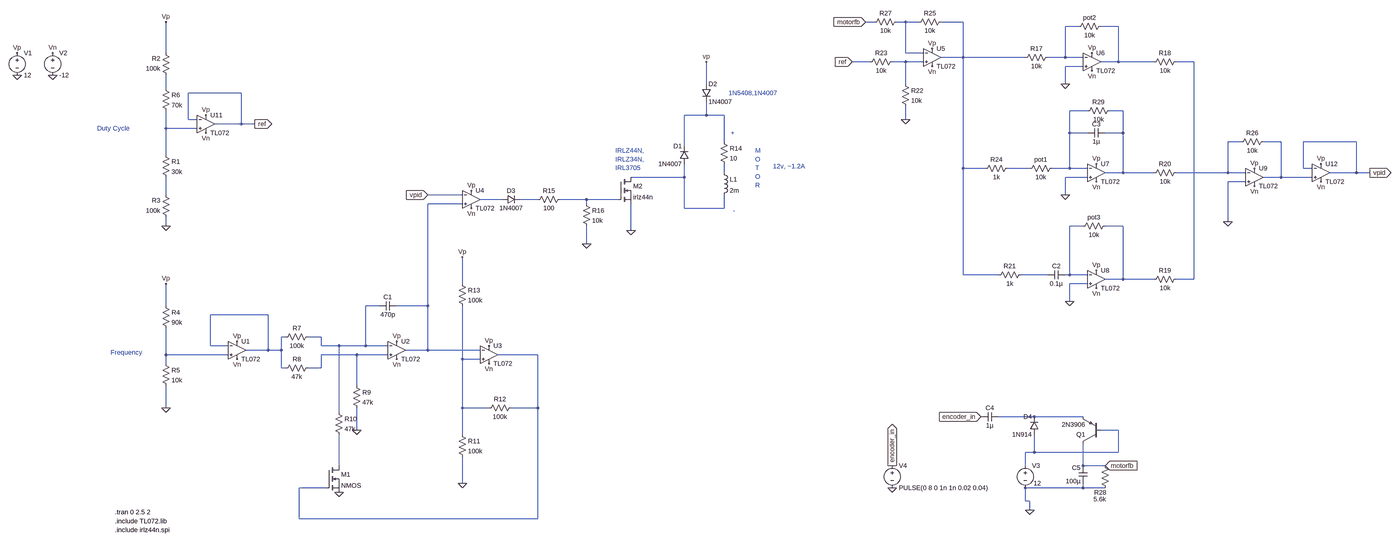
[diagram p0: schematic fvc2.asc, whole sheet]
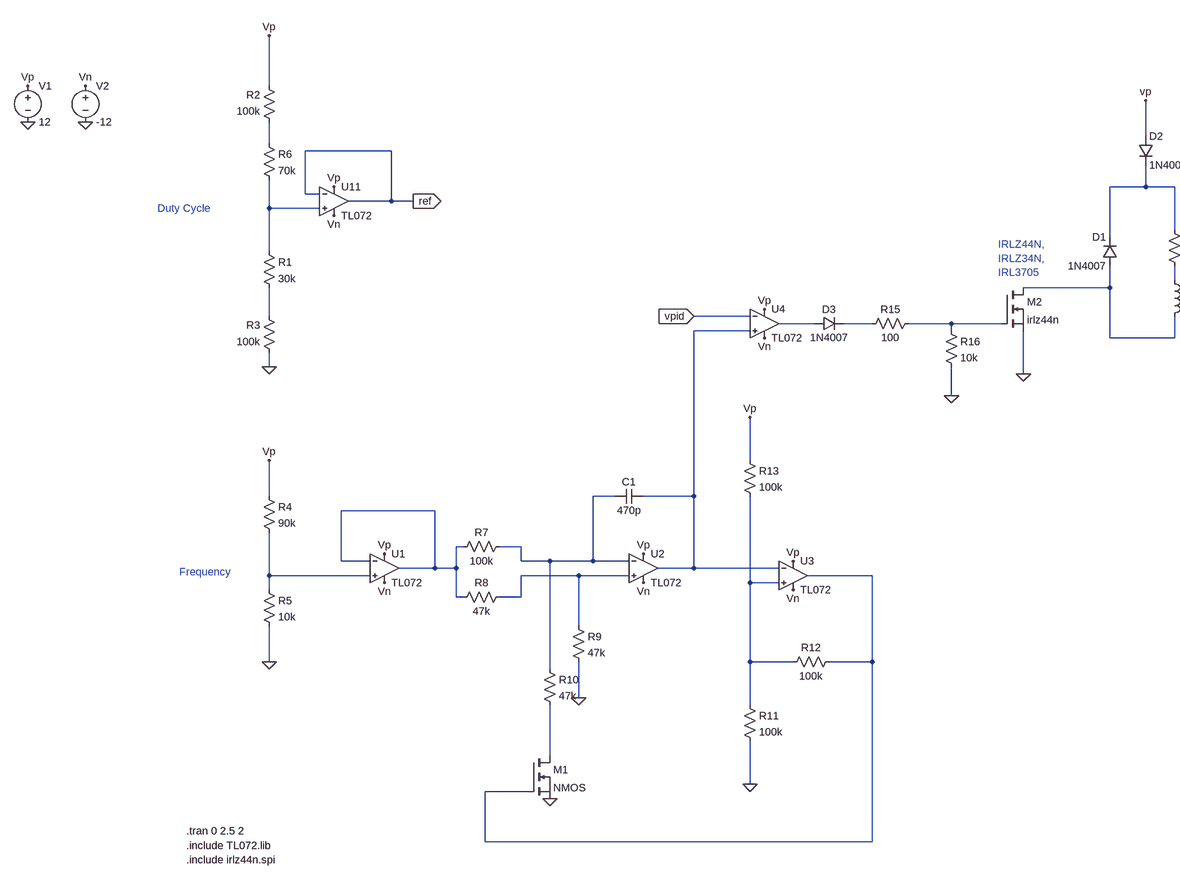
[diagram p1: schematic fvc2.asc, part, row 1 of 1, column 1 of 2]
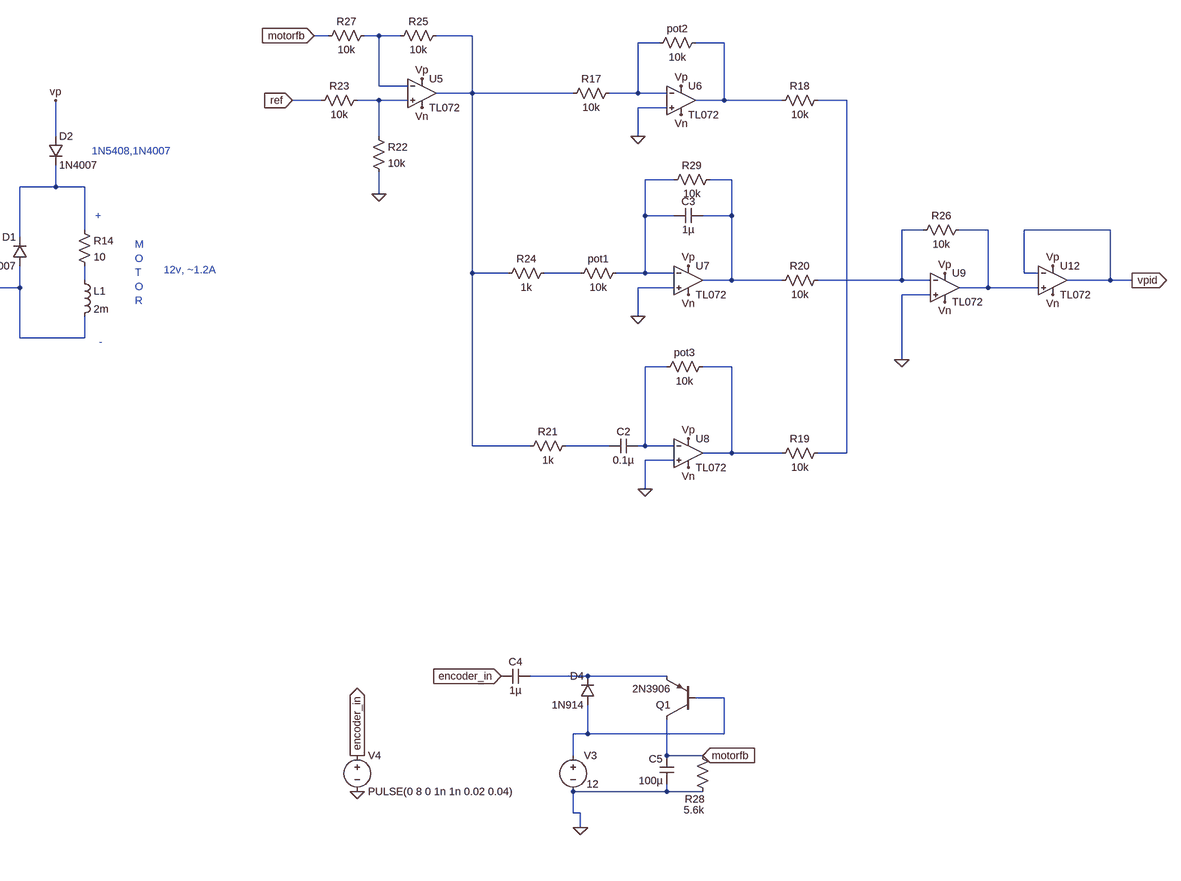
[diagram p2: schematic fvc2.asc, part, row 1 of 1, column 2 of 2]
fvc2.asc, the LTspice schematic file:
Version 4.1
SHEET 1 4284 1492
WIRE 1584 -1024 1552 -1024
WIRE 1696 -1024 1664 -1024
WIRE 1744 -1024 1696 -1024
WIRE 1904 -1024 1824 -1024
WIRE 2320 -1008 2272 -1008
WIRE 2464 -1008 2400 -1008
WIRE -1088 -912 -1088 -1024
WIRE 1696 -912 1696 -1024
WIRE 1760 -912 1696 -912
WIRE 1904 -896 1904 -1024
WIRE 1904 -896 1824 -896
WIRE 2128 -896 1904 -896
WIRE 2272 -896 2272 -1008
WIRE 2272 -896 2208 -896
WIRE 2336 -896 2272 -896
WIRE 1568 -880 1504 -880
WIRE 1696 -880 1648 -880
WIRE 1760 -880 1696 -880
WIRE 2464 -880 2464 -1008
WIRE 2464 -880 2400 -880
WIRE 2592 -880 2464 -880
WIRE 2736 -880 2672 -880
WIRE 2336 -864 2272 -864
WIRE 896 -800 896 -880
WIRE 1696 -800 1696 -880
WIRE 2272 -800 2272 -864
WIRE -1088 -784 -1088 -832
WIRE -816 -768 -1008 -768
WIRE 2352 -704 2288 -704
WIRE 2480 -704 2432 -704
WIRE 896 -688 896 -736
WIRE 896 -688 816 -688
WIRE 960 -688 896 -688
WIRE -1008 -672 -1008 -768
WIRE -976 -672 -1008 -672
WIRE 1696 -672 1696 -720
WIRE -816 -656 -816 -768
WIRE -816 -656 -912 -656
WIRE -768 -656 -816 -656
WIRE -1088 -640 -1088 -704
WIRE -976 -640 -1088 -640
WIRE 2288 -624 2288 -704
WIRE 2352 -624 2288 -624
WIRE 2480 -624 2480 -704
WIRE 2480 -624 2416 -624
WIRE 960 -592 960 -688
WIRE 2928 -592 2880 -592
WIRE 3072 -592 3008 -592
WIRE 3344 -592 3152 -592
WIRE 816 -576 816 -688
WIRE -1088 -544 -1088 -640
WIRE 1904 -496 1904 -896
WIRE 1984 -496 1904 -496
WIRE 2144 -496 2064 -496
WIRE 2288 -496 2288 -624
WIRE 2288 -496 2224 -496
WIRE 2352 -496 2288 -496
WIRE 3152 -496 3152 -592
WIRE 3184 -496 3152 -496
WIRE 960 -480 960 -512
WIRE 2480 -480 2480 -624
WIRE 2480 -480 2416 -480
WIRE 2592 -480 2480 -480
WIRE 2880 -480 2880 -592
WIRE 2880 -480 2672 -480
WIRE 2944 -480 2880 -480
WIRE 3344 -480 3344 -592
WIRE 3344 -480 3248 -480
WIRE 3392 -480 3344 -480
WIRE 816 -464 816 -512
WIRE 816 -464 624 -464
WIRE 2352 -464 2272 -464
WIRE 3072 -464 3072 -592
WIRE 3072 -464 3008 -464
WIRE 3184 -464 3072 -464
WIRE 2944 -448 2880 -448
WIRE -1088 -400 -1088 -464
WIRE 16 -400 -144 -400
WIRE 2272 -400 2272 -464
WIRE 160 -384 80 -384
WIRE 288 -384 224 -384
WIRE 464 -384 368 -384
WIRE 576 -384 464 -384
WIRE 16 -368 -144 -368
WIRE 464 -368 464 -384
WIRE 816 -352 816 -464
WIRE 960 -352 960 -400
WIRE 960 -352 816 -352
WIRE 2880 -304 2880 -448
WIRE -1088 -288 -1088 -320
WIRE 2336 -288 2288 -288
WIRE 2480 -288 2416 -288
WIRE 624 -272 624 -368
WIRE 464 -224 464 -288
WIRE 1904 -112 1904 -496
WIRE 2032 -112 1904 -112
WIRE 2208 -112 2112 -112
WIRE 2288 -112 2288 -288
WIRE 2288 -112 2272 -112
WIRE 2352 -112 2288 -112
WIRE 2480 -96 2480 -288
WIRE 2480 -96 2416 -96
WIRE 2592 -96 2480 -96
WIRE 2736 -96 2736 -880
WIRE 2736 -96 2672 -96
WIRE 16 -80 16 -176
WIRE 2352 -80 2288 -80
WIRE 2288 -16 2288 -80
WIRE -1088 0 -1088 -80
WIRE -320 0 -368 0
WIRE -144 0 -144 -368
WIRE -144 0 -256 0
WIRE -720 32 -928 32
WIRE -656 112 -672 112
WIRE -528 112 -576 112
WIRE -928 144 -928 32
WIRE -864 144 -928 144
WIRE -528 144 -528 112
WIRE -464 144 -528 144
WIRE -368 144 -368 0
WIRE -368 144 -464 144
WIRE -288 144 -368 144
WIRE -720 160 -720 32
WIRE -720 160 -800 160
WIRE -672 160 -672 112
WIRE -672 160 -720 160
WIRE -144 160 -144 0
WIRE -144 160 -224 160
WIRE 80 160 -144 160
WIRE -1088 176 -1088 80
WIRE -864 176 -1088 176
WIRE -400 176 -528 176
WIRE -288 176 -400 176
WIRE 288 176 144 176
WIRE 16 192 16 0
WIRE 80 192 16 192
WIRE -1088 208 -1088 176
WIRE -672 224 -672 160
WIRE -656 224 -672 224
WIRE -528 224 -528 176
WIRE -528 224 -576 224
WIRE -400 288 -400 176
WIRE -1088 368 -1088 288
WIRE 16 368 16 192
WIRE 112 368 16 368
WIRE 288 368 288 176
WIRE 288 368 192 368
WIRE -464 384 -464 144
WIRE 2160 400 2032 400
WIRE 2336 400 2160 400
WIRE -400 448 -400 368
WIRE 2464 448 2400 448
WIRE 16 464 16 368
WIRE 2160 528 2160 464
WIRE 2160 528 2128 528
WIRE 2464 528 2464 448
WIRE 2464 528 2160 528
WIRE -464 576 -464 464
WIRE 2128 576 2128 528
WIRE 2336 576 2336 496
WIRE 2416 576 2336 576
WIRE 16 640 16 544
WIRE -512 656 -608 656
WIRE 2336 656 2336 640
WIRE 2336 656 2128 656
WIRE 2416 656 2336 656
WIRE 2128 704 2128 656
WIRE 2144 704 2128 704
WIRE 2144 736 2144 704
WIRE -608 768 -608 656
WIRE 288 768 288 368
WIRE 288 768 -608 768
FLAG -1648 -832 0
FLAG -1520 -832 0
FLAG -1648 -912 Vp
FLAG -1520 -912 Vn
FLAG -1088 -288 0
FLAG -1088 -1024 Vp
FLAG -1088 -80 Vp
FLAG -1088 368 0
FLAG 48 -416 Vp
FLAG 48 -352 Vn
FLAG 112 208 Vn
FLAG -256 192 Vn
FLAG -832 192 Vn
FLAG 112 144 Vp
FLAG -256 128 Vp
FLAG -832 128 Vp
FLAG -400 448 0
FLAG -464 672 0
FLAG 16 640 0
FLAG 16 -176 Vp
FLAG 624 -272 0
FLAG 464 -224 0
FLAG 896 -880 vp
FLAG 2272 -800 0
FLAG 2272 -400 0
FLAG 2288 -16 0
FLAG 2880 -304 0
FLAG 1696 -672 0
FLAG 1552 -1024 motorfb
IOPIN 1552 -1024 In
FLAG 1504 -880 ref
IOPIN 1504 -880 In
FLAG -768 -656 ref
IOPIN -768 -656 Out
FLAG -144 -400 vpid
IOPIN -144 -400 In
FLAG 2144 736 0
FLAG 1968 400 encoder_in
IOPIN 1968 400 In
FLAG 1648 656 0
FLAG 1648 576 encoder_in
IOPIN 1648 576 Out
FLAG 2416 576 motorfb
IOPIN 2416 576 In
FLAG 3392 -480 vpid
IOPIN 3392 -480 Out
FLAG 1792 -928 Vp
FLAG 1792 -864 Vn
FLAG 2368 -912 Vp
FLAG 2368 -848 Vn
FLAG 2384 -512 Vp
FLAG 2384 -448 Vn
FLAG 2384 -128 Vp
FLAG 2384 -64 Vn
FLAG 2976 -496 Vp
FLAG 2976 -432 Vn
FLAG -944 -688 Vp
FLAG -944 -624 Vn
FLAG 3216 -512 Vp
FLAG 3216 -448 Vn
SYMBOL voltage -1648 -928 R0
WINDOW 123 0 0 Left 0
WINDOW 39 0 0 Left 0
SYMATTR InstName V1
SYMATTR Value 12
SYMBOL voltage -1520 -928 R0
WINDOW 123 0 0 Left 0
WINDOW 39 0 0 Left 0
SYMATTR InstName V2
SYMATTR Value -12
SYMBOL res -1104 -560 R0
SYMATTR InstName R1
SYMATTR Value 30k
SYMATTR SpiceLine tol=10
SYMBOL res -1072 -816 R180
WINDOW 0 36 76 Left 2
WINDOW 3 36 40 Left 2
SYMATTR InstName R2
SYMATTR Value 100k
SYMATTR SpiceLine tol=10
SYMBOL res -1072 -304 R180
WINDOW 0 36 76 Left 2
WINDOW 3 36 40 Left 2
SYMATTR InstName R3
SYMATTR Value 100k
SYMATTR SpiceLine tol=10
SYMBOL res -1104 -16 R0
SYMATTR InstName R4
SYMATTR Value 90k
SYMBOL res -1104 192 R0
SYMATTR InstName R5
SYMATTR Value 10k
SYMBOL res -1104 -800 R0
SYMATTR InstName R6
SYMATTR Value 70k
SYMBOL res -560 96 R90
WINDOW 0 0 56 VBottom 2
WINDOW 3 32 56 VTop 2
SYMATTR InstName R7
SYMATTR Value 100k
SYMATTR SpiceLine tol=10
SYMBOL res -560 208 R90
WINDOW 0 0 56 VBottom 2
WINDOW 3 32 56 VTop 2
SYMATTR InstName R8
SYMATTR Value 47k
SYMATTR SpiceLine tol=10
SYMBOL res -416 272 R0
SYMATTR InstName R9
SYMATTR Value 47k
SYMBOL cap -256 -16 R90
WINDOW 0 0 32 VBottom 2
WINDOW 3 32 32 VTop 2
SYMATTR InstName C1
SYMATTR Value 470p
SYMBOL res -480 368 R0
SYMATTR InstName R10
SYMATTR Value 47k
SYMATTR SpiceLine tol=10
SYMBOL nmos -512 576 R0
SYMATTR InstName M1
SYMBOL res 0 448 R0
SYMATTR InstName R11
SYMATTR Value 100k
SYMATTR SpiceLine tol=10
SYMBOL res 208 352 R90
WINDOW 0 0 56 VBottom 2
WINDOW 3 32 56 VTop 2
SYMATTR InstName R12
SYMATTR Value 100k
SYMATTR SpiceLine tol=10
SYMBOL res 0 -96 R0
SYMATTR InstName R13
SYMATTR Value 100k
SYMATTR SpiceLine tol=10
SYMBOL res 944 -608 R0
SYMATTR InstName R14
SYMATTR Value 10
SYMBOL res 384 -400 R90
WINDOW 0 0 56 VBottom 2
WINDOW 3 32 56 VTop 2
SYMATTR InstName R15
SYMATTR Value 100
SYMBOL res 448 -384 R0
SYMATTR InstName R16
SYMATTR Value 10k
SYMBOL diode 832 -512 R180
WINDOW 0 24 64 Left 2
WINDOW 3 24 0 Left 2
SYMATTR InstName D1
SYMATTR Value 1N4007
SYMBOL diode 880 -800 R0
SYMATTR InstName D2
SYMATTR Value 1N4007
SYMBOL diode 160 -368 R270
WINDOW 0 32 32 VTop 2
WINDOW 3 0 32 VBottom 2
SYMATTR InstName D3
SYMATTR Value 1N4007
SYMBOL nmos 576 -464 R0
SYMATTR InstName M2
SYMATTR Value irlz44n
SYMATTR Prefix X
SYMBOL ind 944 -496 R0
SYMATTR InstName L1
SYMATTR Value 2m
SYMATTR SpiceLine Rser=1m
SYMBOL res 2224 -912 R90
WINDOW 0 0 56 VBottom 2
WINDOW 3 32 56 VTop 2
SYMATTR InstName R17
SYMATTR Value 10k
SYMBOL res 2240 -512 R90
WINDOW 0 0 56 VBottom 2
WINDOW 3 32 56 VTop 2
SYMATTR InstName pot1
SYMATTR Value 10k
SYMBOL res 2688 -896 R90
WINDOW 0 0 56 VBottom 2
WINDOW 3 32 56 VTop 2
SYMATTR InstName R18
SYMATTR Value 10k
SYMBOL res 2688 -112 R90
WINDOW 0 0 56 VBottom 2
WINDOW 3 32 56 VTop 2
SYMATTR InstName R19
SYMATTR Value 10k
SYMBOL res 2688 -496 R90
WINDOW 0 0 56 VBottom 2
WINDOW 3 32 56 VTop 2
SYMATTR InstName R20
SYMATTR Value 10k
SYMBOL res 2128 -128 R90
WINDOW 0 0 56 VBottom 2
WINDOW 3 32 56 VTop 2
SYMATTR InstName R21
SYMATTR Value 1k
SYMBOL res 2416 -1024 R90
WINDOW 0 0 56 VBottom 2
WINDOW 3 32 56 VTop 2
SYMATTR InstName pot2
SYMATTR Value 10k
SYMBOL res 2432 -304 R90
WINDOW 0 0 56 VBottom 2
WINDOW 3 32 56 VTop 2
SYMATTR InstName pot3
SYMATTR Value 10k
SYMBOL cap 2272 -128 R90
WINDOW 0 0 32 VBottom 2
WINDOW 3 32 32 VTop 2
SYMATTR InstName C2
SYMATTR Value 0.1µ
SYMBOL res 1680 -816 R0
SYMATTR InstName R22
SYMATTR Value 10k
SYMBOL res 1664 -896 R90
WINDOW 0 0 56 VBottom 2
WINDOW 3 32 56 VTop 2
SYMATTR InstName R23
SYMATTR Value 10k
SYMBOL res 1968 -480 R270
WINDOW 0 32 56 VTop 2
WINDOW 3 0 56 VBottom 2
SYMATTR InstName R24
SYMATTR Value 1k
SYMBOL res 1840 -1040 R90
WINDOW 0 0 56 VBottom 2
WINDOW 3 32 56 VTop 2
SYMATTR InstName R25
SYMATTR Value 10k
SYMBOL res 3024 -608 R90
WINDOW 0 0 56 VBottom 2
WINDOW 3 32 56 VTop 2
SYMATTR InstName R26
SYMATTR Value 10k
SYMBOL res 1680 -1040 R90
WINDOW 0 0 56 VBottom 2
WINDOW 3 32 56 VTop 2
SYMATTR InstName R27
SYMATTR Value 10k
SYMBOL cap 2416 -640 R90
WINDOW 0 0 32 VBottom 2
WINDOW 3 32 32 VTop 2
SYMATTR InstName C3
SYMATTR Value 1µ
SYMBOL diode 2176 464 R180
WINDOW 0 24 64 Left 2
WINDOW 3 24 0 Left 2
SYMATTR InstName D4
SYMATTR Value 1N914
SYMBOL cap 2032 384 R90
WINDOW 0 0 32 VBottom 2
WINDOW 3 32 32 VTop 2
SYMATTR InstName C4
SYMATTR Value 1µ
SYMBOL pnp 2400 496 R180
SYMATTR InstName Q1
SYMATTR Value 2N3906
SYMBOL voltage 2128 560 R0
WINDOW 123 0 0 Left 0
WINDOW 39 0 0 Left 0
WINDOW 3 30 80 Left 2
SYMATTR Value 12
SYMATTR InstName V3
SYMBOL cap 2320 576 R0
WINDOW 0 -24 8 Left 2
WINDOW 3 -46 56 Left 2
SYMATTR InstName C5
SYMATTR Value 100µ
SYMBOL res 2400 560 R0
WINDOW 0 -24 113 Left 2
WINDOW 3 -26 137 Left 2
SYMATTR InstName R28
SYMATTR Value 5.6k
SYMBOL voltage 1648 560 R0
WINDOW 123 0 0 Left 0
WINDOW 39 0 0 Left 0
SYMATTR InstName V4
SYMATTR Value PULSE(0 8 0 1n 1n 0.02 0.04)
SYMBOL OpAmps\\opamp2 -832 96 R0
SYMATTR InstName U1
SYMATTR Value TL072
SYMBOL OpAmps\\opamp2 -256 96 R0
SYMATTR InstName U2
SYMATTR Value TL072
SYMBOL OpAmps\\opamp2 112 112 R0
SYMATTR InstName U3
SYMATTR Value TL072
SYMBOL OpAmps\\opamp2 48 -448 R0
SYMATTR InstName U4
SYMATTR Value TL072
SYMBOL res 2448 -720 R90
WINDOW 0 0 56 VBottom 2
WINDOW 3 32 56 VTop 2
SYMATTR InstName R29
SYMATTR Value 10k
SYMBOL OpAmps\\opamp2 1792 -960 R0
SYMATTR InstName U5
SYMATTR Value TL072
SYMBOL OpAmps\\opamp2 2368 -944 R0
SYMATTR InstName U6
SYMATTR Value TL072
SYMBOL OpAmps\\opamp2 2384 -544 R0
SYMATTR InstName U7
SYMATTR Value TL072
SYMBOL OpAmps\\opamp2 2384 -160 R0
SYMATTR InstName U8
SYMATTR Value TL072
SYMBOL OpAmps\\opamp2 2976 -528 R0
SYMATTR InstName U9
SYMATTR Value TL072
SYMBOL OpAmps\\opamp2 -944 -720 R0
SYMATTR InstName U11
SYMATTR Value TL072
SYMBOL OpAmps\\opamp2 3216 -544 R0
SYMATTR InstName U12
SYMATTR Value TL072
TEXT -1272 744 Left 2 !.tran 0 2.5 2
TEXT 568 -560 Left 2 ;IRLZ44N,\nIRLZ34N,\nIRL3705
TEXT 984 -624 Left 2 ;+
TEXT 992 -344 Left 2 ;-
TEXT 976 -768 Left 2 ;1N5408,1N4007
TEXT 1072 -560 Left 2 ;M\nO\nT\nO\nR
TEXT 1136 -504 Left 2 ;12v, ~1.2A
TEXT -1336 -640 Left 2 ;Duty Cycle
TEXT -1288 168 Left 2 ;Frequency
TEXT -1272 776 Left 2 !.include TL072.lib
TEXT -1272 808 Left 2 !.include irlz44n.spi

The netlist it stands for:
* fvc2.asc
V1 Vp 0 12
V2 Vn 0 -12
R1 N011 N017 30k tol=10
R2 N007 Vp 100k tol=10
R3 0 N017 100k tol=10
R4 Vp N027 90k
R5 N027 0 10k
R6 N007 N011 70k
R7 N025 N026 100k tol=10
R8 N028 N026 47k tol=10
R9 N028 0 47k
C1 N021 N025 470p
R10 N025 N033 47k tol=10
M1 N033 N029 0 0 NMOS
R11 N030 0 100k tol=10
R12 N029 N030 100k tol=10
R13 Vp N030 100k tol=10
R14 N010 N015 10
R15 N020 N019 100
R16 N020 0 10k
D1 N016 N010 1N4007
D2 Vp N010 1N4007
D3 N018 N019 1N4007
X§M2 N016 N020 0 irlz44n  ; pins D G S
L1 N015 N016 2m Rser=1m
R17 N003 N002 10k
R§pot1 N008 N014 10k
R18 N006 N004 10k
R19 N006 N023 10k
R20 N012 N009 10k
R21 N024 N002 1k
R§pot2 N004 N003 10k
R§pot3 N023 N022 10k
C2 N022 N024 0.1µ
R22 N005 0 10k
R23 N005 ref 10k
R24 N002 N014 1k
R25 N002 N001 10k
R26 N013 N012 10k
R27 N001 motorfb 10k
C3 N009 N008 1µ
D4 N032 N031 1N914
C4 N031 encoder_in 1µ
Q1 motorfb N032 N031 0 2N3906
V3 N032 0 12
C5 motorfb 0 100µ
R28 motorfb 0 5.6k
V4 encoder_in 0 PULSE(0 8 0 1n 1n 0.02 0.04)
X§U1 N027 N026 Vp Vn N026 TL072  ; pins In+ In- V+ V- OUT
X§U2 N028 N025 Vp Vn N021 TL072  ; pins In+ In- V+ V- OUT
X§U3 N030 N021 Vp Vn N029 TL072  ; pins In+ In- V+ V- OUT
X§U4 N021 vpid Vp Vn N018 TL072  ; pins In+ In- V+ V- OUT
R29 N009 N008 10k
X§U5 N005 N001 Vp Vn N002 TL072  ; pins In+ In- V+ V- OUT
X§U6 0 N003 Vp Vn N004 TL072  ; pins In+ In- V+ V- OUT
X§U7 0 N008 Vp Vn N009 TL072  ; pins In+ In- V+ V- OUT
X§U8 0 N022 Vp Vn N023 TL072  ; pins In+ In- V+ V- OUT
X§U9 0 N012 Vp Vn N013 TL072  ; pins In+ In- V+ V- OUT
X§U11 N011 ref Vp Vn ref TL072  ; pins In+ In- V+ V- OUT
X§U12 N013 vpid Vp Vn vpid TL072  ; pins In+ In- V+ V- OUT
.model D D
.lib standard.dio
.model NPN NPN
.model PNP PNP
.lib standard.bjt
.model NMOS NMOS
.model PMOS PMOS
.lib standard.mos
.tran 0 2.5 2
* IRLZ44N,
* IRLZ34N,
* IRL3705
* +
* -
* 1N5408,1N4007
* M
* O
* T
* O
* R
* 12v, ~1.2A
* Duty Cycle
* Frequency
.include TL072.lib
.include irlz44n.spi
.backanno
.end